# Altium project BenEater_8bitComp.PrjPcb
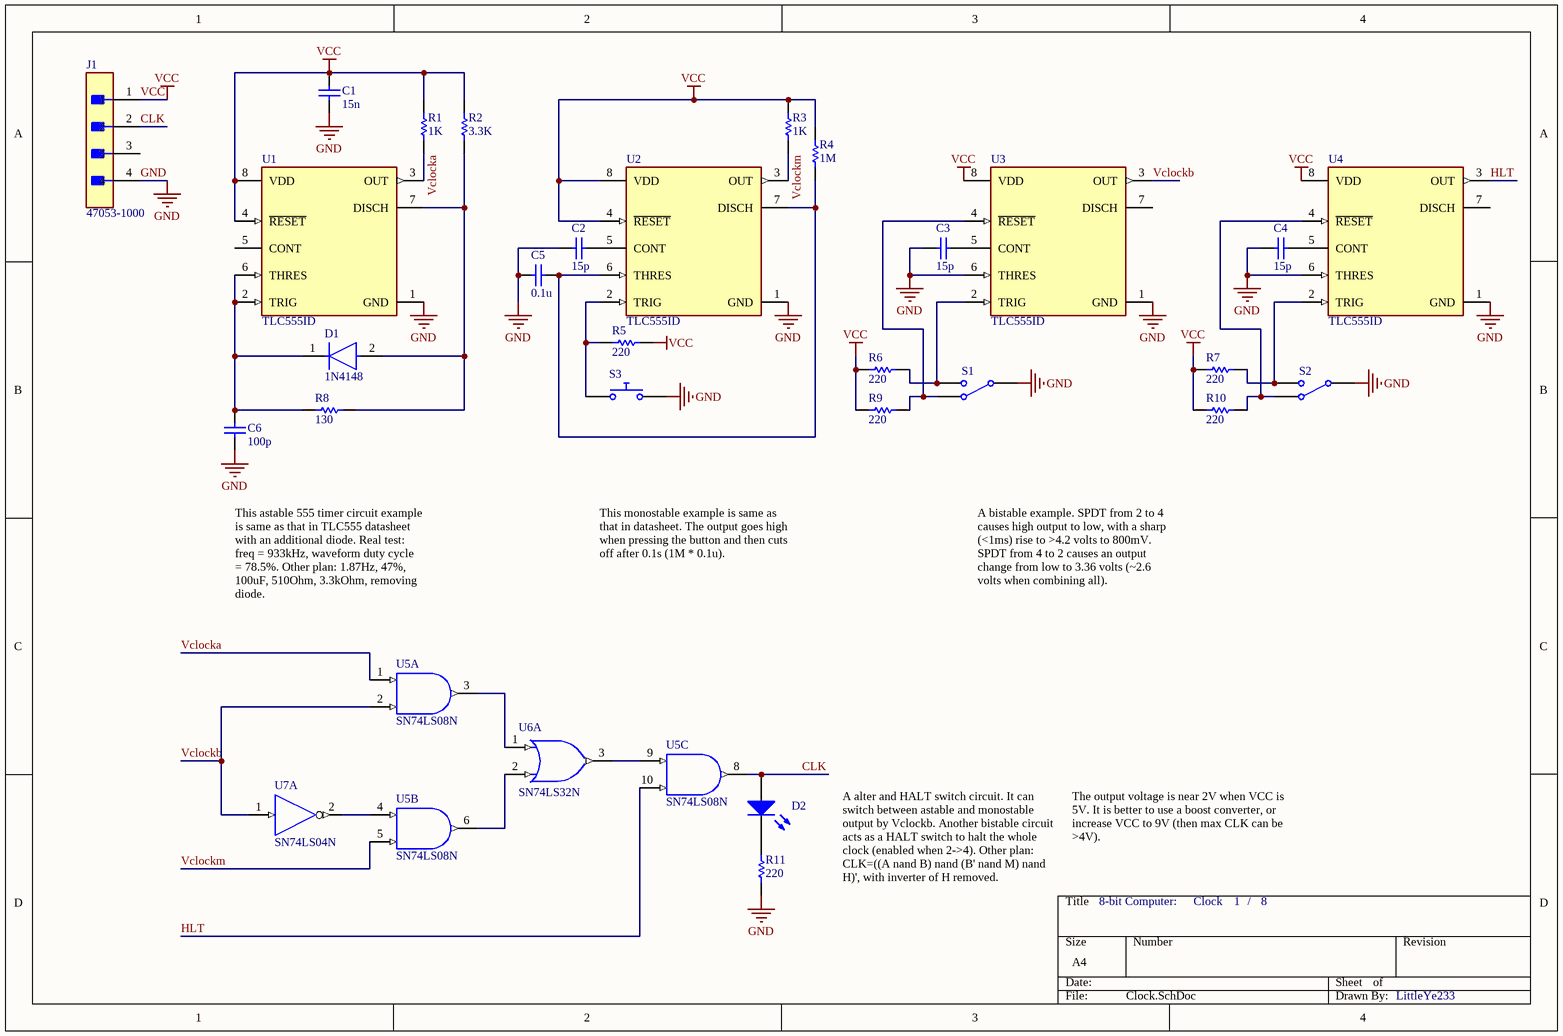
[diagram p0: Clock.SchDoc]
8 sheets, 190 parts. Net scope: global (net labels, ports and power ports of the same name join across sheets).
Sheets:
  Clock.SchDoc
  RegisterA.SchDoc
  RegisterB.SchDoc
  RegisterInstruction.SchDoc
  ALU.SchDoc
  RegisterMemAddr.SchDoc
  RAM.SchDoc
  ProgramCounter.SchDoc

## Sheet Clock.SchDoc: Clock
size A4; Author: Ben Eater; DrawnBy: LittleYe233; DocumentNumber: 1; SheetNumber: 1; SheetTotal: 8

### Parts
C1  value 15n  (hidden comment: Capacitor)
C2  value 15p  (hidden comment: Capacitor)
C3  value 15p  (hidden comment: Capacitor)
C4  value 15p  (hidden comment: Capacitor)
C5  value 0.1u  (hidden comment: Capacitor)
C6  value 100p  (hidden comment: Capacitor)
D1  1N4148  [FP-017AG-MFG]
D2  Light-Emitting Diode  (value not drawn)
J1  47053-1000  [FP-470531000-MFG]
R1  value 1K  (hidden comment: Resistor)
R2  value 3.3K  (hidden comment: Resistor)
R3  value 1K  (hidden comment: Resistor)
R4  value 1M  (hidden comment: Resistor)
R5  value 220  (hidden comment: Resistor)
R6  value 220  (hidden comment: Resistor)
R7  value 220  (hidden comment: Resistor)
R8  value 130  (hidden comment: Resistor)
R9  value 220  (hidden comment: Resistor)
R10  value 220  (hidden comment: Resistor)
R11  value 220  (hidden comment: Resistor)
S1  Single-Pole, Double-Throw Switch  (value not drawn)
S2  Single-Pole, Double-Throw Switch  (value not drawn)
S3  Push Button Normally Opened  (value not drawn)
U1  TLC555ID  [FP-D0008A-IPC_B]
U2  TLC555ID  [FP-D0008A-IPC_B]
U3  TLC555ID  [FP-D0008A-IPC_B]
U4  TLC555ID  [FP-D0008A-IPC_B]
U5  SN74LS08N  [N0014A]  (parts A,B,C of 5)
U6  SN74LS32N  [N0014A]  (part A of 5)
U7  SN74LS04N  [N0014A]  (part A of 7)

### Nets
GND: C1.1 C2.2 C3.2 C4.2 C5.2 C6.1 J1.4 R11.1 S1.1 S2.1 S3.2 U1.1(GND) U2.1(GND) U3.1(GND) U3.6(THRES) U4.1(GND) U4.6(THRES)
VCC: C1.2 J1.1 R1.2 R2.2 R3.2 R4.2 R5.1 R6.1 R7.1 R9.2 R10.2 U1.4(~{RESET}) U1.8(VDD) U2.4(~{RESET}) U2.8(VDD) U3.8(VDD) U4.8(VDD)
CLK: D2.1(A) J1.2 U5.8(3Y)
HLT: U4.3(OUT) U5.10(3B)
Vclocka: R1.1 U1.3(OUT) U5.1(1A)
Vclockb: U3.3(OUT) U5.2(1B) U7.1(1A)
Vclockm: R3.1 U2.3(OUT) U5.5(2B)
NetC2_1: C2.1 U2.5(CONT)
NetC3_1: C3.1 U3.5(CONT)
NetC4_1: C4.1 U4.5(CONT)
NetC5_1: C5.1 R4.1 U2.6(THRES) U2.7(DISCH)
NetC6_2: C6.2 D1.1(C) R8.1 U1.2(TRIG) U1.6(THRES)
NetD1_2: D1.2(A) R2.1 R8.2 U1.7(DISCH)
NetD2_2: D2.2(K) R11.2
NetR5_2: R5.2 S3.1 U2.2(TRIG)
NetR6_2: R6.2 S1.2 U3.2(TRIG)
NetR7_2: R7.2 S2.2 U4.2(TRIG)
NetR9_1: R9.1 S1.3 U3.4(~{RESET})
NetR10_1: R10.1 S2.3 U4.4(~{RESET})
NetU5_3: U5.3(1Y) U6.1(1A)
NetU5_4: U5.4(2A) U7.2(~{1Y})
NetU5_6: U5.6(2Y) U6.2(1B)
NetU5_9: U5.9(3A) U6.3(1Y)

Not connected (* = marked no-connect by the designer): J1 3; U1 5(CONT); U3 7(DISCH); U4 7(DISCH)

### Notes on the sheet
- This monostable example is same as that in datasheet. The output goes high when pressing the button and then cuts off after 0.1s (1M * 0.1u).
- A bistable example. SPDT from 2 to 4 causes high output to low, with a sharp (<1ms) rise to >4.2 volts to 800mV. SPDT from 4 to 2 causes an output change from low to 3.36 volts (~2.6 volts when combining all).
- This astable 555 timer circuit example is same as that in TLC555 datasheet with an additional diode. Real test: freq = 933kHz, waveform duty cycle = 78.5%. Other plan: 1.87Hz, 47%, 100uF, 510Ohm, 3.3kOhm, removing diode.
- The output voltage is near 2V when VCC is 5V. It is better to use a boost converter, or increase VCC to 9V (then max CLK can be >4V).
- A alter and HALT switch circuit. It can switch between astable and monostable output by Vclockb. Another bistable circuit acts as a HALT switch to halt the whole clock (enabled when 2->4). Other plan: CLK=((A nand B) nand (B' nand M) nand H)', with inverter of H removed.
- 8-bit Computer:
- /

### Library data of the parts
C1-C6 = Capacitor: SimulationGenericComponent: True
D1 = CMP-07163-000046-1: DIODE GEN PURP 100V 200MA DO35; Forward Voltage: 1V; Max Power Dissipation: 500mW; Max Reverse Current: 5uA; Forward Current: 300mA; Current: 4A; Reverse Recovery Time: 4ns; Element Configuration: Single; Outside Diameter: 1.85mm; Capacitance: 4pF; Polarity: Standard; Max Forward Surge Current (Ifsm): 1A; Reverse Voltage: 100V; Output Current: 200mA; Average Rectified Current: 200mA; Diameter: 1.91mm; Max Repetitive Reverse Voltage (Vrrm): 100V; Current Rating: 200mA; Case/Package: DO-35; Lead Free: Lead Free; Number of Pins: 2; Recovery Time: 4ns; Packaging: Bulk; Contact Plating: Tin; Voltage: 100V; Mount: Through Hole; Max Surge Current: 4A; Package Quantity: 2000; Width: 1.91mm; Max Reverse Voltage (DC): 100V; Length: 4.56mm; Radiation Hardening: No; Power Dissipation: 500mW; Voltage Rating (DC): 100V; Peak Non-Repetitive Surge Current: 4A; REACH SVHC: No SVHC; Height: 4.56mm; Max Operating Temperature: 175°C; Series: -; Weight: 0.01lb; Min Operating Temperature: -65°C
D2 = LED: AF: 1; BV: 0; BV_MAX: 1e99; EG: 1.11; FC: 0.5; IBV: 0.001; IS: 1e-14; MJSW: 0.33; NTUN: 30; TNOM: 27; XTI: 3; SimulationGenericComponent: True; CJO: 0; CJP: 0; CTA: 0; CTP: 0; FCS: 0.5; FV_MAX: 1e99; IKF: 0; IKR: 0; ISR: 1e-14; JSW: 0; JTUN: 0; JTUNSW: 0; KEG: 1; KF: 0; LEVEL: 1; N: 1; NBV: 1; NR: 1; NS: 1; PHP: 1; RS: 0; TCV: 0; TLEV: 0; TLEVC: 0; TM1: 0; TM2: 0; TPB: 0; TPHP: 0; TRS: 0; TRS2: 0; TT: 0; TTT1: 0; TTT2: 0; VJ: 1; XTITUN: 3
J1 = CMP-04776-000290-2: CONN HEADER VERT 4POS 2.54MM; NexarPartId: 854935; Manufacturer Lifecycle Status: ACTIVE; Voltage Rating (DC): 250V; Gender: Male; Plating: Copper; Number of Positions: 4; Glow Wire Compliant: Non-compliant; Current Rating: 500mA; Max Operating Temperature: 75°C; Number of Rows: 1; REACH SVHC: Unknown; Ambient Temperature Range High: 105°C; Pitch: 2.54mm; Height: 7.7mm; Min Operating Temperature: 0°C; Packaging: Bulk; Contact Material: Brass, Copper; Contact Plating: Tin; Lead Pitch: 2.54mm; Voltage Rating: 250V; Termination: Through Hole; Radiation Hardening: No; Orientation: Vertical; Mount: Through Hole; Number of Pins: 4; Country of Origin: HK; Halogen Free: Low Halogen; Lifecycle Status: Production; Number of Circuits: 4; Schedule B: 8536694040, 8536694040|8536694040|8536694040|8536694040|8536694040|8536694040|8536694040|8536694040|8536694040|8536694040|8536694040|8536694040|8536694040|8536694040|8536694040|8536694040|8536694040|8536694040|8536694040|8536694040|8536694040|8536694040|8536694040|85; Housing Color: Beige; Housing Material: Nylon; Depth: 5.84mm; RoHS: Compliant; Length: 10.2mm; Number of Contacts: 4
R1-R11 = Resistor: TC1: 0; SimulationGenericComponent: True; TC2: 0
S1 S2 = SPDT SW: nodeUP_closed: 1; Rclosed: 1m; Ropen: 1Meg; SimulationGenericComponent: True
S3 = Push Button NO: closed: 0; Rclosed: 1m; Ropen: 1Meg; SimulationGenericComponent: True
U1-U4 = CMP-04858-000007-1: IC OSC SGL TIMER 2.1MHZ 8-SOIC; Manufacturer: Texas Instruments; Nominal Supply Current: 170-360uA; Min Supply Voltage: 3V; Max Supply Voltage: 15V; Number Of Timers/Counters: 1; Standoff Height: 0.11mm; RoHS: TRUE; Package: D0008A; Automotive: No; ComponentLink2Description: Datasheet; Category: IC; Mouser Description: Timers & Support Products CMOS; Ambient Temperature Range High: +85°C; Device Class L1: Integrated Circuits (ICs); Lead Free: Yes; Temperature: -40°C to +85°C; Frequency: 2.1MHz; Device Class L2: Clock and Timing; ComponentLink2URL: http://www.ti.com/lit/ds/symlink/tlc555.pdf; Ambient Temperature Range Low: -40°C; Device Class L3: Timers and Oscillators; Temperature Range High: +85°C; Temperature Range Low: -40°C; Octopart: https://octopart.com/tlc555id-texas+instruments-516571; Digikey Description: IC OSC SGL TIMER 2.1MHZ 8-SOIC; Height: 1.75mm; Manufacturer Part Number: TLC555ID
U5 = CMP-0777-00259-3: Quadruple 2-Input Positive-AND Gates, N0014A, TUBE; Manufacturer: Texas Instruments; VCC(Max)(V): 5.25; ICC @ Nom Voltage(Max)(mA): 0.021; VCC(Min)(V): 4.75; tpd @ Nom Voltage(Max)(ns): 25; Rating: Catalog; Output Type: TTL; Bits(#): 4; Schmitt Trigger: No; Voltage(Nom)(V): 5; Technology Family: LS; F @ Nom Voltage(Max)(Mhz): 35; Output Drive (IOL/IOH)(Max)(mA): -0.8/16; PackageReference: N0014A; DatasheetVersion: SDLS033; Input Type: TTL; Operating Temperature Range(C): 0 to 70; Generic Part Number: SN74LS08
U6 = CMP-1573-00145-3: Quad 2-input positive-OR gates, N0014A, TUBE; Manufacturer: Texas Instruments; tpd @ Nom Voltage(Max)(ns): 22; Output Drive (IOL/IOH)(Max)(mA): 0.8/-16; Input Type: TTL; VCC(Min)(V): 4.75; F @ Nom Voltage(Max)(Mhz): 35; Voltage(Nom)(V): 5; ICC @ Nom Voltage(Max)(mA): 0.038; VCC(Max)(V): 5.25; Rating: Catalog; Bits(#): 4; Generic Part Number: SN74LS32; DatasheetVersion: SDLS100; Operating Temperature Range(C): 0 to 70; Output Type: TTL; Code_JEDEC: MS-001; PackageVersion: http://www.ti.com/lit/ml/mpdi002c/mpdi002c.pdf; PackageReference: N0014A
U7 = CMP-1615-00911-2: Hex inverters, N0014A, TUBE; Manufacturer: Texas Instruments; Output Drive (IOL/IOH)(Max)(mA): -0.4/8; Schmitt Trigger: No; F @ Nom Voltage(Max)(Mhz): 35; Voltage(Nom)(V): 5; Technology Family: LS; Input Type: TTL; Output Type: CMOS; Bits(#): 6; VCC(Max)(V): 5.25; ICC @ Nom Voltage(Max)(mA): 0.033; Rating: Catalog; VCC(Min)(V): 4.75; tpd @ Nom Voltage(Max)(ns): 22; Operating Temperature Range(C): 0 to 70; DatasheetVersion: SDLS029C; Generic Part Number: SN74LS04; Code_JEDEC: MS-001; PackageReference: N0014A

## Sheet RegisterA.SchDoc: A Register
size A4; Author: Ben Eater; DrawnBy: LittleYe233; DocumentNumber: 2; SheetNumber: 2; SheetTotal: 7
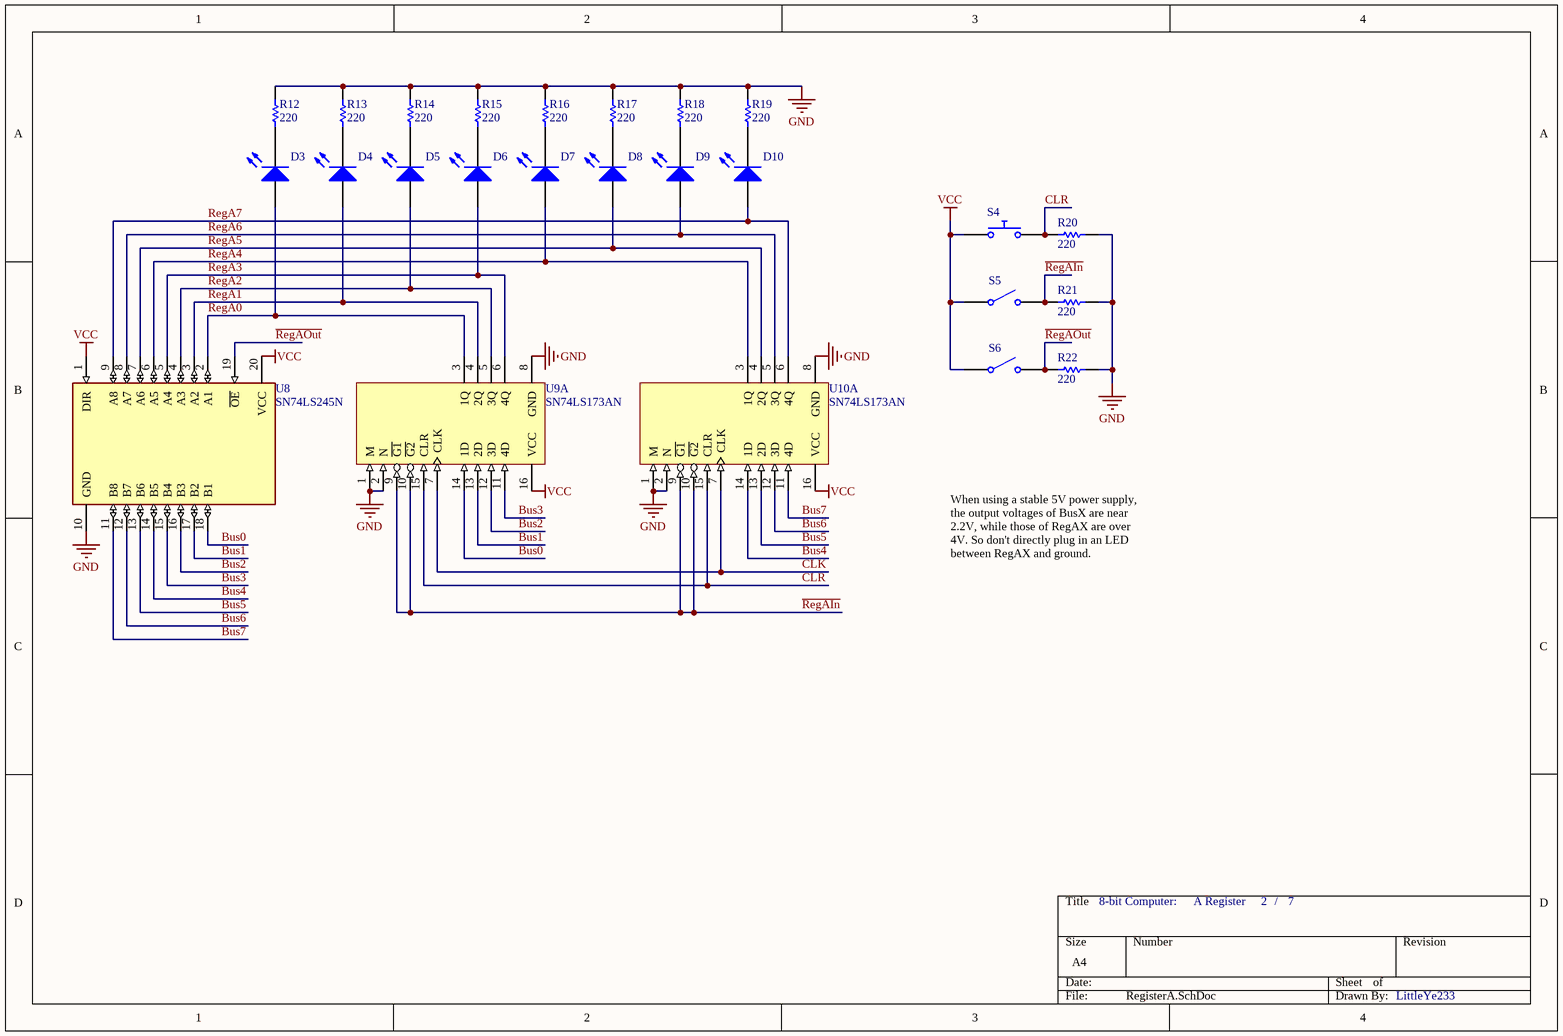
[diagram p1: RegisterA.SchDoc]

### Parts
D3  Light-Emitting Diode  (value not drawn)
D4  Light-Emitting Diode  (value not drawn)
D5  Light-Emitting Diode  (value not drawn)
D6  Light-Emitting Diode  (value not drawn)
D7  Light-Emitting Diode  (value not drawn)
D8  Light-Emitting Diode  (value not drawn)
D9  Light-Emitting Diode  (value not drawn)
D10  Light-Emitting Diode  (value not drawn)
R12  value 220  (hidden comment: Resistor)
R13  value 220  (hidden comment: Resistor)
R14  value 220  (hidden comment: Resistor)
R15  value 220  (hidden comment: Resistor)
R16  value 220  (hidden comment: Resistor)
R17  value 220  (hidden comment: Resistor)
R18  value 220  (hidden comment: Resistor)
R19  value 220  (hidden comment: Resistor)
R20  value 220  (hidden comment: Resistor)
R21  value 220  (hidden comment: Resistor)
R22  value 220  (hidden comment: Resistor)
S4  Push Button Normally Opened  (value not drawn)
S5  Single-Pole, Single-Throw Switch  (value not drawn)
S6  Single-Pole, Single-Throw Switch  (value not drawn)
U8  SN74LS245N  [FP-N0020A-MFG]
U9  SN74LS173AN  [N0016A]  (part A of 2)
U10  SN74LS173AN  [N0016A]  (part A of 2)

### Nets
GND: R12.2 R13.2 R14.2 R15.2 R16.2 R17.2 R18.2 R19.2 R20.1 R21.1 R22.1 U8.10(GND) U9.1(M) U9.2(N) U9.8(GND) U10.1(M) U10.2(N) U10.8(GND)
VCC: S4.1 S5.1 S6.1 U8.1(DIR) U8.20(VCC) U9.16(VCC) U10.16(VCC)
Bus0: U8.18(B1) U9.14(1D)
Bus1: U8.17(B2) U9.13(2D)
Bus2: U8.16(B3) U9.12(3D)
Bus3: U8.15(B4) U9.11(4D)
Bus4: U8.14(B5) U10.14(1D)
Bus5: U8.13(B6) U10.13(2D)
Bus6: U8.12(B7) U10.12(3D)
Bus7: U8.11(B8) U10.11(4D)
CLK: U9.7(CLK) U10.7(CLK)
CLR: R20.2 S4.2 U9.15(CLR) U10.15(CLR)
~{RegAIn}: R21.2 S5.2 U9.9(~{G1}) U9.10(~{G2}) U10.9(~{G1}) U10.10(~{G2})
~{RegAOut}: R22.2 S6.2 U8.19(~{OE})
RegA0: D3.1(A) U8.2(A1) U9.3(1Q)
RegA1: D4.1(A) U8.3(A2) U9.4(2Q)
RegA2: D5.1(A) U8.4(A3) U9.5(3Q)
RegA3: D6.1(A) U8.5(A4) U9.6(4Q)
RegA4: D7.1(A) U8.6(A5) U10.3(1Q)
RegA5: D8.1(A) U8.7(A6) U10.4(2Q)
RegA6: D9.1(A) U8.8(A7) U10.5(3Q)
RegA7: D10.1(A) U8.9(A8) U10.6(4Q)
NetD3_2: D3.2(K) R12.1
NetD4_2: D4.2(K) R13.1
NetD5_2: D5.2(K) R14.1
NetD6_2: D6.2(K) R15.1
NetD7_2: D7.2(K) R16.1
NetD8_2: D8.2(K) R17.1
NetD9_2: D9.2(K) R18.1
NetD10_2: D10.2(K) R19.1

### Notes on the sheet
- When using a stable 5V power supply, the output voltages of BusX are near 2.2V, while those of RegAX are over 4V. So don't directly plug in an LED between RegAX and ground.
- 8-bit Computer:
- /

### Library data of the parts
D3-D10 = LED: as D2 on sheet Clock; CJO: 0; CJP: 0; CTA: 0; CTP: 0; FCS: 0.5; FV_MAX: 1e99; IKF: 0; IKR: 0; ISR: 1e-14; JSW: 0; JTUN: 0; JTUNSW: 0; KEG: 1; KF: 0; LEVEL: 1; N: 1; NBV: 1; NR: 1; NS: 1; PHP: 1; RS: 0; TCV: 0; TLEV: 0; TLEVC: 0; TM1: 0; TM2: 0; TPB: 0; TPHP: 0; TRS: 0; TRS2: 0; TT: 0; TTT1: 0; TTT2: 0; VJ: 1; XTITUN: 3
R12-R22 = Resistor: TC1: 0; SimulationGenericComponent: True; TC2: 0
S4 = Push Button NO: as S3 on sheet Clock
S5 S6 = SPST SW: closed: 0; Rclosed: 1m; Ropen: 1Meg; SimulationGenericComponent: True
U8 = CMP-1620-00419-3: IC TXRX NON-INVERT 5.25V 20DIP; Number of Bits per Element: 8; Polarity: Non-Inverting; Low Level Output Current: 24mA; Propagation Delay: 12ns; Min Supply Voltage: 4.75V; Number of Elements: 1; Quiescent Current: 62mA; Logic Function: Transceiver; Direction: Bidirectional; Operating Supply Voltage: 5V; High Level Output Current: -15mA; Mount: Through Hole; Min Operating Temperature: 0°C; Number of Outputs: 8; Max Operating Temperature: 70°C; Max Supply Voltage: 5.25V; Width: 6.35mm; Number of Pins: 20; RoHS Compliant: Yes; Turn-On Delay Time: 12ns; Termination: Through Hole; Number of Channels: 8; Number of Circuits: 8; Weight: 0.042297oz; Package Quantity: 20; Number of Transceivers: 8; Length: 24.33mm; Height: 4.57mm; REACH SVHC: No SVHC; Contact Plating: Gold; Number of Bits: 8; Lead Free: Lead Free; Case/Package: PDIP; Packaging: Rail/Tube; Radiation Hardening: No
U9 U10 = CMP-1619-00777-2: 4-Bit D-type Registers with 3-State Outputs, N0016A, TUBE; Manufacturer: Texas Instruments; VCC(Max)(V): 5.25; ICC @ Nom Voltage(Max)(mA): 24; F @ Nom Voltage(Max)(Mhz): 35; Bits(#): 4; tpd @ Nom Voltage(Max)(ns): 30; Output Logic: Non-inverted; VCC(Min)(V): 4.75; 3-State Output: Yes; Voltage(Nom)(V): 5; Output Drive (IOL/IOH)(Max)(mA): 24/-2.6; Rating: Catalog; Output: 3S; Input Type: TTL; Technology Family: LS; Schmitt Trigger: No; Operating Temperature Range(C): 0 to 70; DatasheetVersion: SDLS067A; Generic Part Number: SN74LS173A; Output Type: TTL; PackageReference: N0016A; Code_JEDEC: MS-001

## Sheet RegisterB.SchDoc: B Register
size A4; Author: Ben Eater; DrawnBy: LittleYe233; SheetNumber: 3; SheetTotal: 6
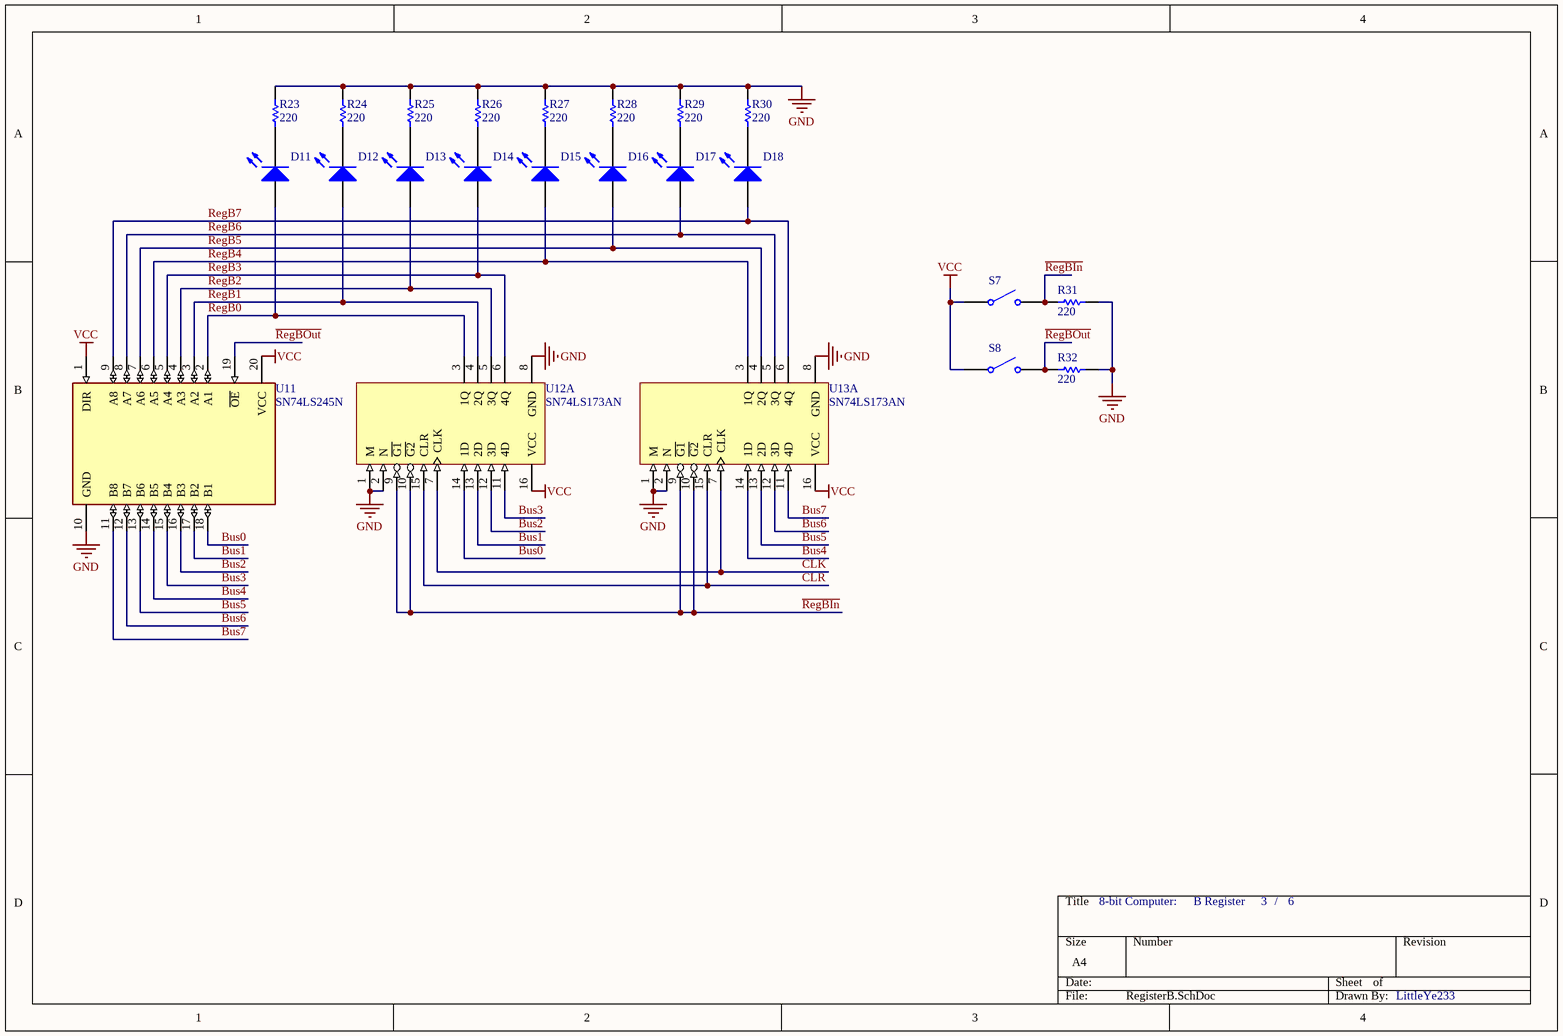
[diagram p2: RegisterB.SchDoc]

### Parts
D11  Light-Emitting Diode  (value not drawn)
D12  Light-Emitting Diode  (value not drawn)
D13  Light-Emitting Diode  (value not drawn)
D14  Light-Emitting Diode  (value not drawn)
D15  Light-Emitting Diode  (value not drawn)
D16  Light-Emitting Diode  (value not drawn)
D17  Light-Emitting Diode  (value not drawn)
D18  Light-Emitting Diode  (value not drawn)
R23  value 220  (hidden comment: Resistor)
R24  value 220  (hidden comment: Resistor)
R25  value 220  (hidden comment: Resistor)
R26  value 220  (hidden comment: Resistor)
R27  value 220  (hidden comment: Resistor)
R28  value 220  (hidden comment: Resistor)
R29  value 220  (hidden comment: Resistor)
R30  value 220  (hidden comment: Resistor)
R31  value 220  (hidden comment: Resistor)
R32  value 220  (hidden comment: Resistor)
S7  Single-Pole, Single-Throw Switch  (value not drawn)
S8  Single-Pole, Single-Throw Switch  (value not drawn)
U11  SN74LS245N  [FP-N0020A-MFG]
U12  SN74LS173AN  [N0016A]  (part A of 2)
U13  SN74LS173AN  [N0016A]  (part A of 2)

### Nets
GND: R23.2 R24.2 R25.2 R26.2 R27.2 R28.2 R29.2 R30.2 R31.1 R32.1 U11.10(GND) U12.1(M) U12.2(N) U12.8(GND) U13.1(M) U13.2(N) U13.8(GND)
VCC: S7.1 S8.1 U11.1(DIR) U11.20(VCC) U12.16(VCC) U13.16(VCC)
Bus0: U11.18(B1) U12.14(1D)
Bus1: U11.17(B2) U12.13(2D)
Bus2: U11.16(B3) U12.12(3D)
Bus3: U11.15(B4) U12.11(4D)
Bus4: U11.14(B5) U13.14(1D)
Bus5: U11.13(B6) U13.13(2D)
Bus6: U11.12(B7) U13.12(3D)
Bus7: U11.11(B8) U13.11(4D)
CLK: U12.7(CLK) U13.7(CLK)
CLR: U12.15(CLR) U13.15(CLR)
~{RegBIn}: R31.2 S7.2 U12.9(~{G1}) U12.10(~{G2}) U13.9(~{G1}) U13.10(~{G2})
~{RegBOut}: R32.2 S8.2 U11.19(~{OE})
RegB0: D11.1(A) U11.2(A1) U12.3(1Q)
RegB1: D12.1(A) U11.3(A2) U12.4(2Q)
RegB2: D13.1(A) U11.4(A3) U12.5(3Q)
RegB3: D14.1(A) U11.5(A4) U12.6(4Q)
RegB4: D15.1(A) U11.6(A5) U13.3(1Q)
RegB5: D16.1(A) U11.7(A6) U13.4(2Q)
RegB6: D17.1(A) U11.8(A7) U13.5(3Q)
RegB7: D18.1(A) U11.9(A8) U13.6(4Q)
NetD11_2: D11.2(K) R23.1
NetD12_2: D12.2(K) R24.1
NetD13_2: D13.2(K) R25.1
NetD14_2: D14.2(K) R26.1
NetD15_2: D15.2(K) R27.1
NetD16_2: D16.2(K) R28.1
NetD17_2: D17.2(K) R29.1
NetD18_2: D18.2(K) R30.1

### Notes on the sheet
- 8-bit Computer:
- /

### Library data of the parts
D11-D18 = LED: as D2 on sheet Clock; CJO: 0; CJP: 0; CTA: 0; CTP: 0; FCS: 0.5; FV_MAX: 1e99; IKF: 0; IKR: 0; ISR: 1e-14; JSW: 0; JTUN: 0; JTUNSW: 0; KEG: 1; KF: 0; LEVEL: 1; N: 1; NBV: 1; NR: 1; NS: 1; PHP: 1; RS: 0; TCV: 0; TLEV: 0; TLEVC: 0; TM1: 0; TM2: 0; TPB: 0; TPHP: 0; TRS: 0; TRS2: 0; TT: 0; TTT1: 0; TTT2: 0; VJ: 1; XTITUN: 3
R23-R32 = Resistor: TC1: 0; SimulationGenericComponent: True; TC2: 0
S7 S8 = SPST SW: as S5 on sheet RegisterA
U11 = CMP-1620-00419-3: as U8 on sheet RegisterA; Mount: Through Hole; Min Operating Temperature: 0°C; Number of Outputs: 8; Max Operating Temperature: 70°C; Max Supply Voltage: 5.25V; Width: 6.35mm; Number of Pins: 20; RoHS Compliant: Yes; Turn-On Delay Time: 12ns; Termination: Through Hole; Number of Channels: 8; Number of Circuits: 8; Weight: 0.042297oz; Package Quantity: 20; Number of Transceivers: 8; Length: 24.33mm; Height: 4.57mm; REACH SVHC: No SVHC; Contact Plating: Gold; Number of Bits: 8; Lead Free: Lead Free; Case/Package: PDIP; Packaging: Rail/Tube; Radiation Hardening: No
U12 U13 = CMP-1619-00777-2: as U9 on sheet RegisterA; Operating Temperature Range(C): 0 to 70; DatasheetVersion: SDLS067A; Generic Part Number: SN74LS173A; Output Type: TTL; PackageReference: N0016A; Code_JEDEC: MS-001

## Sheet RegisterInstruction.SchDoc: Instruction Register
size A4; Author: Ben Eater; DrawnBy: LittleYe233; SheetNumber: 4; SheetTotal: 7
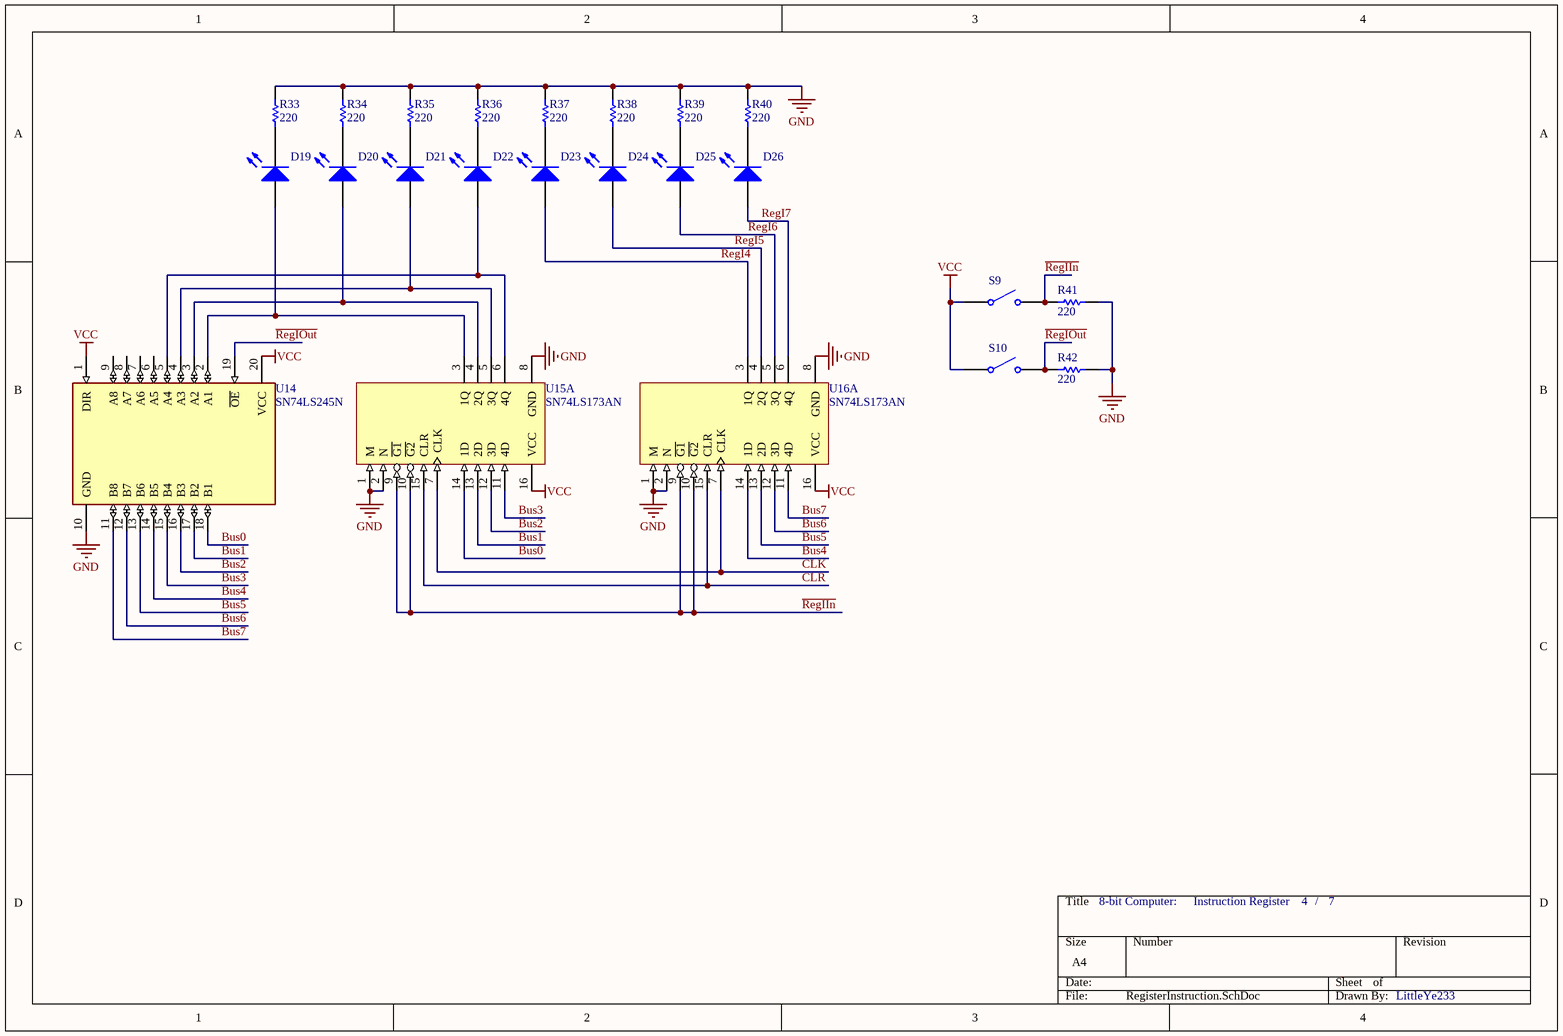
[diagram p3: RegisterInstruction.SchDoc]

### Parts
D19  Light-Emitting Diode  (value not drawn)
D20  Light-Emitting Diode  (value not drawn)
D21  Light-Emitting Diode  (value not drawn)
D22  Light-Emitting Diode  (value not drawn)
D23  Light-Emitting Diode  (value not drawn)
D24  Light-Emitting Diode  (value not drawn)
D25  Light-Emitting Diode  (value not drawn)
D26  Light-Emitting Diode  (value not drawn)
R33  value 220  (hidden comment: Resistor)
R34  value 220  (hidden comment: Resistor)
R35  value 220  (hidden comment: Resistor)
R36  value 220  (hidden comment: Resistor)
R37  value 220  (hidden comment: Resistor)
R38  value 220  (hidden comment: Resistor)
R39  value 220  (hidden comment: Resistor)
R40  value 220  (hidden comment: Resistor)
R41  value 220  (hidden comment: Resistor)
R42  value 220  (hidden comment: Resistor)
S9  Single-Pole, Single-Throw Switch  (value not drawn)
S10  Single-Pole, Single-Throw Switch  (value not drawn)
U14  SN74LS245N  [FP-N0020A-MFG]
U15  SN74LS173AN  [N0016A]  (part A of 2)
U16  SN74LS173AN  [N0016A]  (part A of 2)

### Nets
GND: R33.2 R34.2 R35.2 R36.2 R37.2 R38.2 R39.2 R40.2 R41.1 R42.1 U14.10(GND) U15.1(M) U15.2(N) U15.8(GND) U16.1(M) U16.2(N) U16.8(GND)
VCC: S9.1 S10.1 U14.1(DIR) U14.20(VCC) U15.16(VCC) U16.16(VCC)
Bus0: U14.18(B1) U15.14(1D)
Bus1: U14.17(B2) U15.13(2D)
Bus2: U14.16(B3) U15.12(3D)
Bus3: U14.15(B4) U15.11(4D)
Bus4: U14.14(B5) U16.14(1D)
Bus5: U14.13(B6) U16.13(2D)
Bus6: U14.12(B7) U16.12(3D)
Bus7: U14.11(B8) U16.11(4D)
CLK: U15.7(CLK) U16.7(CLK)
CLR: U15.15(CLR) U16.15(CLR)
~{RegIIn}: R41.2 S9.2 U15.9(~{G1}) U15.10(~{G2}) U16.9(~{G1}) U16.10(~{G2})
~{RegIOut}: R42.2 S10.2 U14.19(~{OE})
RegI4: D23.1(A) U16.3(1Q)
RegI5: D24.1(A) U16.4(2Q)
RegI6: D25.1(A) U16.5(3Q)
RegI7: D26.1(A) U16.6(4Q)
NetD19_1: D19.1(A) U14.2(A1) U15.3(1Q)
NetD19_2: D19.2(K) R33.1
NetD20_1: D20.1(A) U14.3(A2) U15.4(2Q)
NetD20_2: D20.2(K) R34.1
NetD21_1: D21.1(A) U14.4(A3) U15.5(3Q)
NetD21_2: D21.2(K) R35.1
NetD22_1: D22.1(A) U14.5(A4) U15.6(4Q)
NetD22_2: D22.2(K) R36.1
NetD23_2: D23.2(K) R37.1
NetD24_2: D24.2(K) R38.1
NetD25_2: D25.2(K) R39.1
NetD26_2: D26.2(K) R40.1

Not connected (* = marked no-connect by the designer): U14 6(A5) 7(A6) 8(A7) 9(A8)

### Notes on the sheet
- 8-bit Computer:
- /

### Library data of the parts
D19-D26 = LED: as D2 on sheet Clock; CJO: 0; CJP: 0; CTA: 0; CTP: 0; FCS: 0.5; FV_MAX: 1e99; IKF: 0; IKR: 0; ISR: 1e-14; JSW: 0; JTUN: 0; JTUNSW: 0; KEG: 1; KF: 0; LEVEL: 1; N: 1; NBV: 1; NR: 1; NS: 1; PHP: 1; RS: 0; TCV: 0; TLEV: 0; TLEVC: 0; TM1: 0; TM2: 0; TPB: 0; TPHP: 0; TRS: 0; TRS2: 0; TT: 0; TTT1: 0; TTT2: 0; VJ: 1; XTITUN: 3
R33-R42 = Resistor: TC1: 0; SimulationGenericComponent: True; TC2: 0
S9 S10 = SPST SW: as S5 on sheet RegisterA
U14 = CMP-1620-00419-3: as U8 on sheet RegisterA; Mount: Through Hole; Min Operating Temperature: 0°C; Number of Outputs: 8; Max Operating Temperature: 70°C; Max Supply Voltage: 5.25V; Width: 6.35mm; Number of Pins: 20; RoHS Compliant: Yes; Turn-On Delay Time: 12ns; Termination: Through Hole; Number of Channels: 8; Number of Circuits: 8; Weight: 0.042297oz; Package Quantity: 20; Number of Transceivers: 8; Length: 24.33mm; Height: 4.57mm; REACH SVHC: No SVHC; Contact Plating: Gold; Number of Bits: 8; Lead Free: Lead Free; Case/Package: PDIP; Packaging: Rail/Tube; Radiation Hardening: No
U15 U16 = CMP-1619-00777-2: as U9 on sheet RegisterA; Operating Temperature Range(C): 0 to 70; DatasheetVersion: SDLS067A; Generic Part Number: SN74LS173A; Output Type: TTL; PackageReference: N0016A; Code_JEDEC: MS-001

## Sheet ALU.SchDoc: ALU
size A4; Author: Ben Eater; DrawnBy: LittleYe233; SheetNumber: 5; SheetTotal: 6
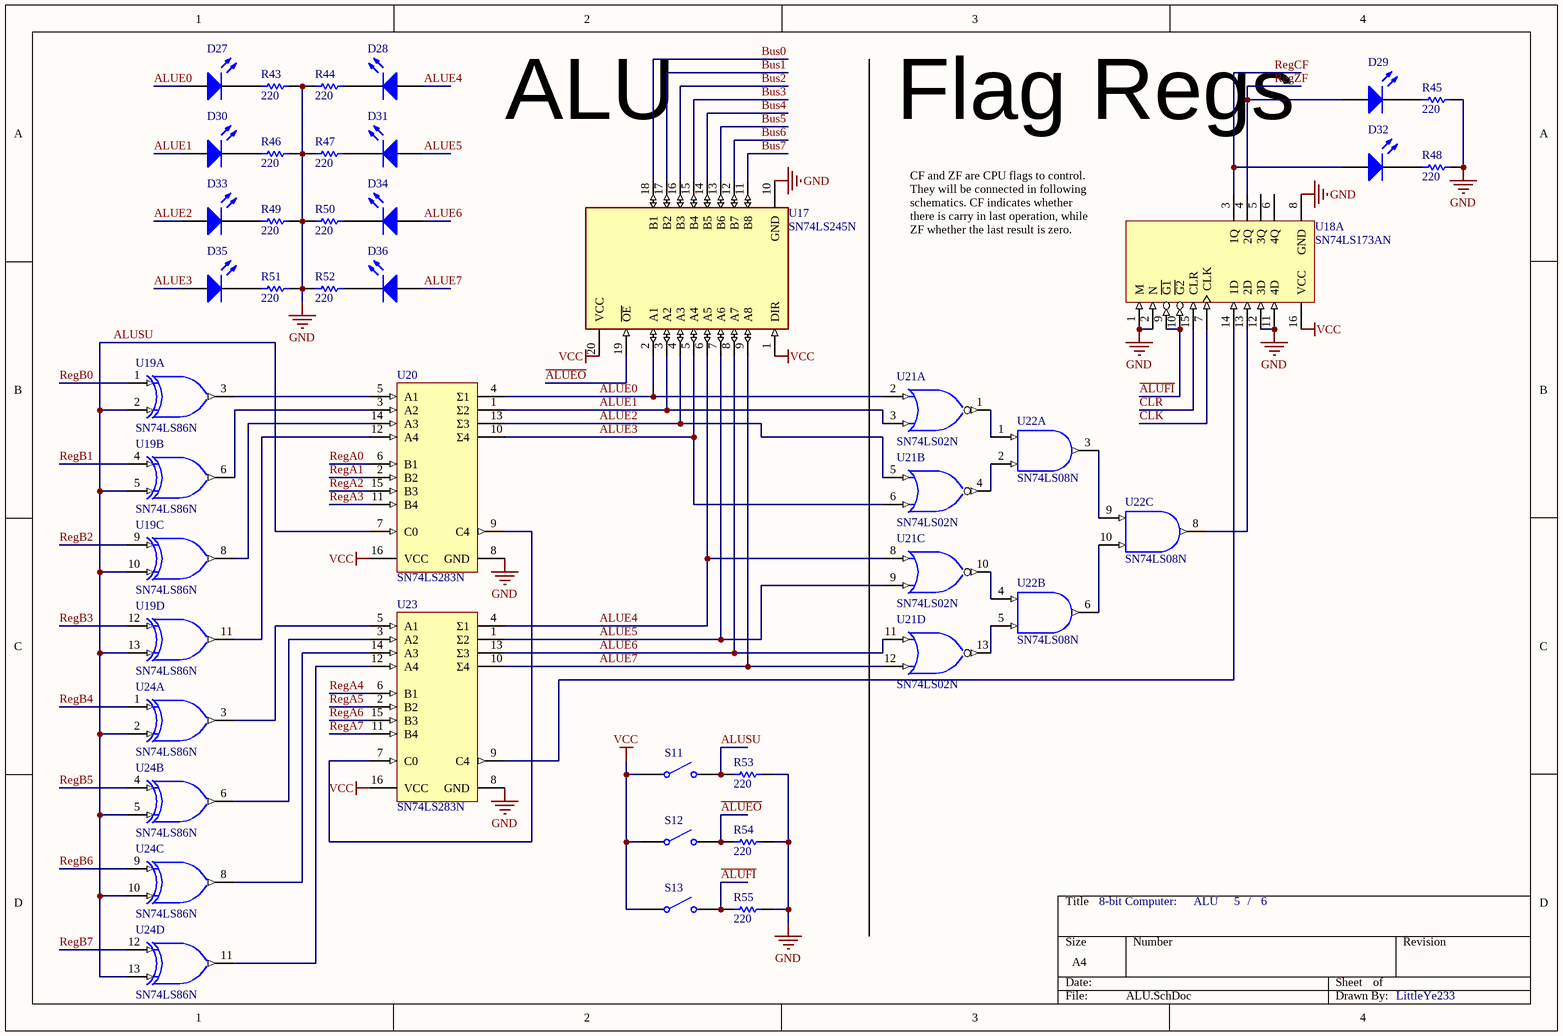
[diagram p4: ALU.SchDoc]

### Parts
D27  Light-Emitting Diode  (value not drawn)
D28  Light-Emitting Diode  (value not drawn)
D29  Light-Emitting Diode  (value not drawn)
D30  Light-Emitting Diode  (value not drawn)
D31  Light-Emitting Diode  (value not drawn)
D32  Light-Emitting Diode  (value not drawn)
D33  Light-Emitting Diode  (value not drawn)
D34  Light-Emitting Diode  (value not drawn)
D35  Light-Emitting Diode  (value not drawn)
D36  Light-Emitting Diode  (value not drawn)
R43  value 220  (hidden comment: Resistor)
R44  value 220  (hidden comment: Resistor)
R45  value 220  (hidden comment: Resistor)
R46  value 220  (hidden comment: Resistor)
R47  value 220  (hidden comment: Resistor)
R48  value 220  (hidden comment: Resistor)
R49  value 220  (hidden comment: Resistor)
R50  value 220  (hidden comment: Resistor)
R51  value 220  (hidden comment: Resistor)
R52  value 220  (hidden comment: Resistor)
R53  value 220  (hidden comment: Resistor)
R54  value 220  (hidden comment: Resistor)
R55  value 220  (hidden comment: Resistor)
S11  Single-Pole, Single-Throw Switch  (value not drawn)
S12  Single-Pole, Single-Throw Switch  (value not drawn)
S13  Single-Pole, Single-Throw Switch  (value not drawn)
U17  SN74LS245N  [FP-N0020A-MFG]
U18  SN74LS173AN  [N0016A]  (part A of 2)
U19  SN74LS86N  (parts A,B,C,D of 5)
U20  SN74LS283N  [N0016A]
U21  SN74LS02N  [N0014A]  (parts A,B,C,D of 5)
U22  SN74LS08N  [N0014A]  (parts A,B,C of 5)
U23  SN74LS283N  [N0016A]
U24  SN74LS86N  (parts A,B,C,D of 5)

### Nets
GND: R43.2 R44.1 R45.2 R46.2 R47.1 R48.2 R49.2 R50.1 R51.2 R52.1 R53.1 R54.1 R55.1 U17.10(GND) U18.1(M) U18.2(N) U18.8(GND) U18.11(4D) U18.12(3D) U20.8(GND) U23.8(GND)
VCC: S11.1 S12.1 S13.1 U17.1(DIR) U17.20(VCC) U18.16(VCC) U20.16(VCC) U23.16(VCC)
~{ALUEO}: R54.2 S12.2 U17.19(~{OE})
~{ALUFI}: R55.2 S13.2 U18.9(~{G1}) U18.10(~{G2})
ALUE0: D27.1(A) U17.2(A1) U20.4(Σ1) U21.2(1A)
ALUE1: D30.1(A) U17.3(A2) U20.1(Σ2) U21.3(1B)
ALUE2: D33.1(A) U17.4(A3) U20.13(Σ3) U21.5(2A)
ALUE3: D35.1(A) U17.5(A4) U20.10(Σ4) U21.6(2B)
ALUE4: D28.1(A) U17.6(A5) U21.8(3A) U23.4(Σ1)
ALUE5: D31.1(A) U17.7(A6) U21.9(3B) U23.1(Σ2)
ALUE6: D34.1(A) U17.8(A7) U21.11(4A) U23.13(Σ3)
ALUE7: D36.1(A) U17.9(A8) U21.12(4B) U23.10(Σ4)
ALUSU: R53.2 S11.2 U19.2(1B) U19.5(2B) U19.10(3B) U19.13(4B) U20.7(C0) U24.2(1B) U24.5(2B) U24.10(3B) U24.13(4B)
Bus0: U17.18(B1)
Bus1: U17.17(B2)
Bus2: U17.16(B3)
Bus3: U17.15(B4)
Bus4: U17.14(B5)
Bus5: U17.13(B6)
Bus6: U17.12(B7)
Bus7: U17.11(B8)
CLK: U18.7(CLK)
CLR: U18.15(CLR)
RegA0: U20.6(B1)
RegA1: U20.2(B2)
RegA2: U20.15(B3)
RegA3: U20.11(B4)
RegA4: U23.6(B1)
RegA5: U23.2(B2)
RegA6: U23.15(B3)
RegA7: U23.11(B4)
RegB0: U19.1(1A)
RegB1: U19.4(2A)
RegB2: U19.9(3A)
RegB3: U19.12(4A)
RegB4: U24.1(1A)
RegB5: U24.4(2A)
RegB6: U24.9(3A)
RegB7: U24.12(4A)
RegCF: D32.1(A) U18.3(1Q)
RegZF: D29.1(A) U18.4(2Q)
NetD27_2: D27.2(K) R43.1
NetD28_2: D28.2(K) R44.2
NetD29_2: D29.2(K) R45.1
NetD30_2: D30.2(K) R46.1
NetD31_2: D31.2(K) R47.2
NetD32_2: D32.2(K) R48.1
NetD33_2: D33.2(K) R49.1
NetD34_2: D34.2(K) R50.2
NetD35_2: D35.2(K) R51.1
NetD36_2: D36.2(K) R52.2
NetU18_13: U18.13(2D) U22.8(3Y)
NetU18_14: U18.14(1D) U23.9(C4)
NetU19_3: U19.3(1Y) U20.5(A1)
NetU19_6: U19.6(2Y) U20.3(A2)
NetU19_8: U19.8(3Y) U20.14(A3)
NetU19_11: U19.11(4Y) U20.12(A4)
NetU20_9: U20.9(C4) U23.7(C0)
NetU21_1: U21.1(1Y) U22.1(1A)
NetU21_4: U21.4(2Y) U22.2(1B)
NetU21_10: U21.10(3Y) U22.4(2A)
NetU21_13: U21.13(4Y) U22.5(2B)
NetU22_3: U22.3(1Y) U22.9(3A)
NetU22_6: U22.6(2Y) U22.10(3B)
NetU23_3: U23.3(A2) U24.6(2Y)
NetU23_5: U23.5(A1) U24.3(1Y)
NetU23_12: U23.12(A4) U24.11(4Y)
NetU23_14: U23.14(A3) U24.8(3Y)

Not connected (* = marked no-connect by the designer): U18 5(3Q) 6(4Q)

### Notes on the sheet
- ALU
- Flag Regs
- (near U18) CF and ZF are CPU flags to control. They will be connected in following schematics. CF indicates whether there is carry in last operation, while ZF whether the last result is zero.
- 8-bit Computer:
- /

### Library data of the parts
D27-D36 = LED: as D2 on sheet Clock; CJO: 0; CJP: 0; CTA: 0; CTP: 0; FCS: 0.5; FV_MAX: 1e99; IKF: 0; IKR: 0; ISR: 1e-14; JSW: 0; JTUN: 0; JTUNSW: 0; KEG: 1; KF: 0; LEVEL: 1; N: 1; NBV: 1; NR: 1; NS: 1; PHP: 1; RS: 0; TCV: 0; TLEV: 0; TLEVC: 0; TM1: 0; TM2: 0; TPB: 0; TPHP: 0; TRS: 0; TRS2: 0; TT: 0; TTT1: 0; TTT2: 0; VJ: 1; XTITUN: 3
R43-R55 = Resistor: TC1: 0; SimulationGenericComponent: True; TC2: 0
S11-S13 = SPST SW: as S5 on sheet RegisterA
U17 = CMP-1620-00419-3: as U8 on sheet RegisterA; Mount: Through Hole; Min Operating Temperature: 0°C; Number of Outputs: 8; Max Operating Temperature: 70°C; Max Supply Voltage: 5.25V; Width: 6.35mm; Number of Pins: 20; RoHS Compliant: Yes; Turn-On Delay Time: 12ns; Termination: Through Hole; Number of Channels: 8; Number of Circuits: 8; Weight: 0.042297oz; Package Quantity: 20; Number of Transceivers: 8; Length: 24.33mm; Height: 4.57mm; REACH SVHC: No SVHC; Contact Plating: Gold; Number of Bits: 8; Lead Free: Lead Free; Case/Package: PDIP; Packaging: Rail/Tube; Radiation Hardening: No
U18 = CMP-1619-00777-2: as U9 on sheet RegisterA; Operating Temperature Range(C): 0 to 70; DatasheetVersion: SDLS067A; Generic Part Number: SN74LS173A; Output Type: TTL; PackageReference: N0016A; Code_JEDEC: MS-001
U20 U23 = CMP-1623-00518-2: 4-Bit Binary Full Adders With Fast Carry, N0016A, TUBE; Manufacturer: Texas Instruments; VCC(Min)(V): 4.75; Output Type: CMOS; Inputs: 9; Bits(#): 4; F @ Nom Voltage(Max)(Mhz): 35; Voltage(Nom)(V): 5; Rating: Catalog; tpd @ Nom Voltage(Max)(ns): 24; Schmitt Trigger: No; Technology Family: LS; Output Drive (IOL/IOH)(Max)(mA): 8/-0.4; Input Type: TTL; VCC(Max)(V): 5.25; Function: Arithmetic; ICC @ Nom Voltage(Max)(mA): 34; DatasheetVersion: SDLS095A; PackageReference: N0016A; Generic Part Number: SN74LS283; Type: Binary; Code_JEDEC: MS-001; Operating Temperature Range(C): 0 to 70
U21 = CMP-0806-00181-3: Quad 2-input positive-NOR gates, N0014A, TUBE; Manufacturer: Texas Instruments; Output Drive (IOL/IOH)(Max)(mA): 0.4/-8; F @ Nom Voltage(Max)(Mhz): 35; VCC(Max)(V): 5.25; Bits(#): 4; Input Type: TTL; VCC(Min)(V): 4.75; ICC @ Nom Voltage(Max)(mA): 0.027; tpd @ Nom Voltage(Max)(ns): 22; Voltage(Nom)(V): 5; Rating: Catalog; Generic Part Number: SN74LS02; PackageReference: N0014A; Operating Temperature Range(C): 0 to 70; DatasheetVersion: SDLS027; PackageVersion: http://www.ti.com/lit/ml/mpdi002c/mpdi002c.pdf; Output Type: TTL; Code_JEDEC: MS-001
U22 = CMP-0777-00259-3: as U5 on sheet Clock; PackageReference: N0014A; DatasheetVersion: SDLS033; Input Type: TTL; Operating Temperature Range(C): 0 to 70; Generic Part Number: SN74LS08

## Sheet RegisterMemAddr.SchDoc: Memory Address Register
size A4; Author: Ben Eater; DrawnBy: LittleYe233; SheetNumber: 6; SheetTotal: 6
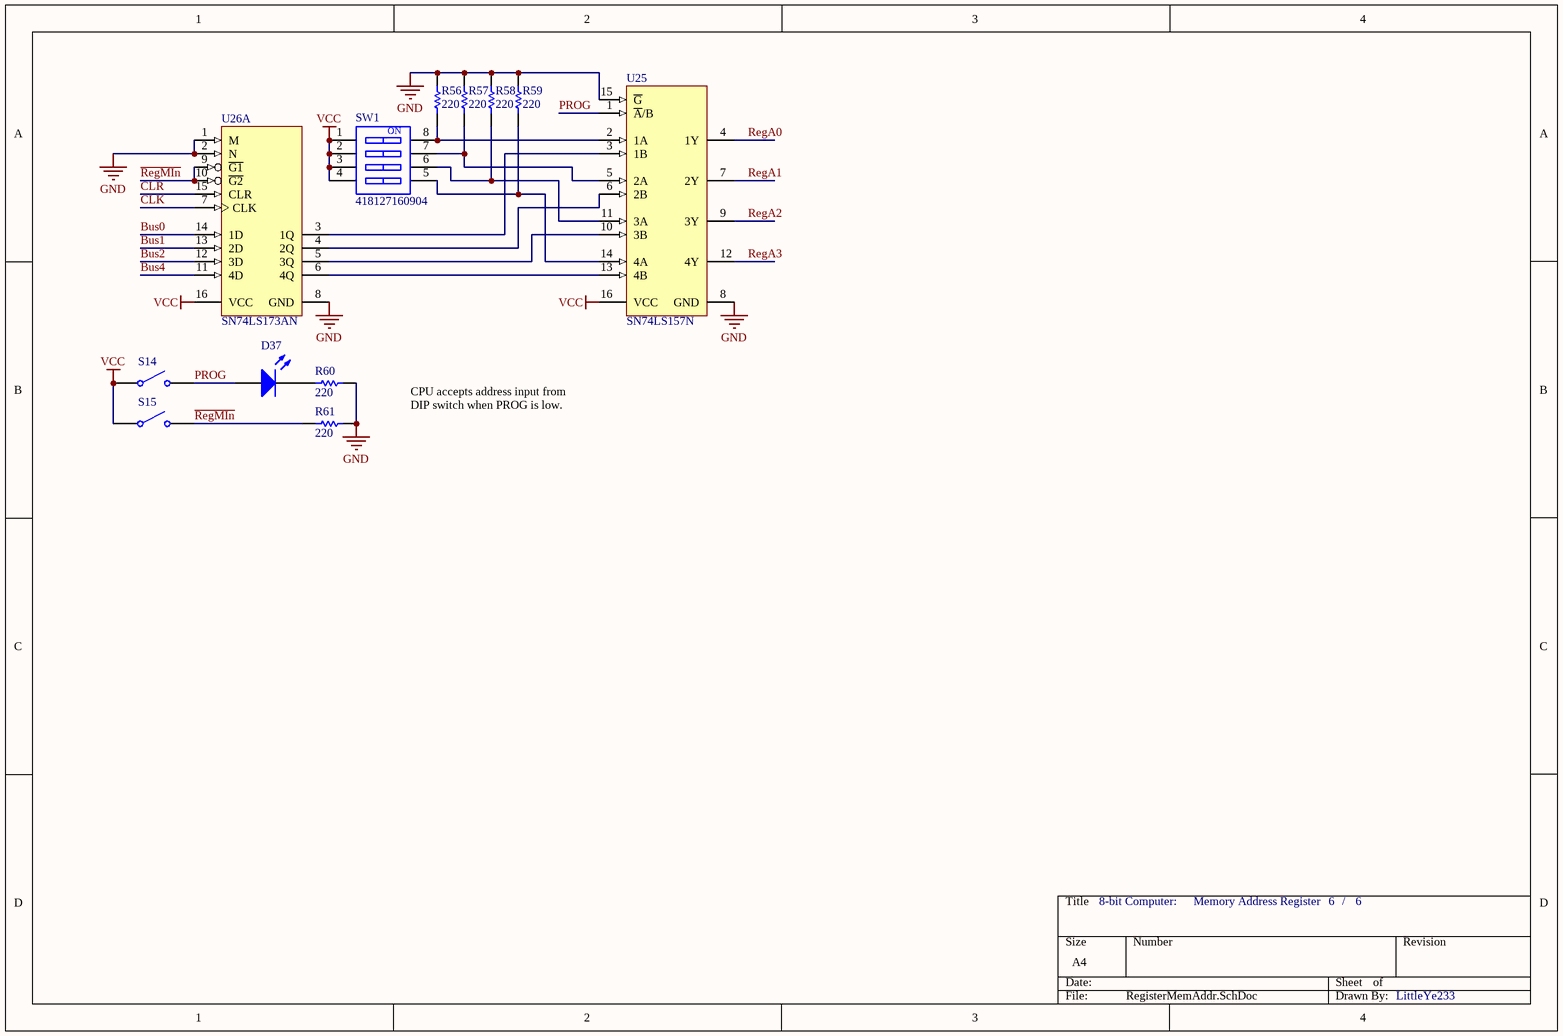
[diagram p5: RegisterMemAddr.SchDoc]

### Parts
D37  Light-Emitting Diode  (value not drawn)
R56  value 220  (hidden comment: Resistor)
R57  value 220  (hidden comment: Resistor)
R58  value 220  (hidden comment: Resistor)
R59  value 220  (hidden comment: Resistor)
R60  value 220  (hidden comment: Resistor)
R61  value 220  (hidden comment: Resistor)
S14  Single-Pole, Single-Throw Switch  (value not drawn)
S15  Single-Pole, Single-Throw Switch  (value not drawn)
SW1  418127160904  [418127160904]
U25  SN74LS157N  [N0016A]
U26  SN74LS173AN  [N0016A]  (part A of 2)

### Nets
GND: R56.2 R57.2 R58.2 R59.2 R60.1 R61.1 U25.8(GND) U25.15(~{G}) U26.1(M) U26.2(N) U26.8(GND)
VCC: S14.1 S15.1 SW1.1 SW1.2 SW1.3 SW1.4 U25.16(VCC) U26.16(VCC)
Bus0: U26.14(1D)
Bus1: U26.13(2D)
Bus2: U26.12(3D)
Bus4: U26.11(4D)
CLK: U26.7(CLK)
CLR: U26.15(CLR)
PROG: D37.1(A) S14.2 U25.1(~{A}/B)
~{RegMIn}: R61.2 S15.2 U26.9(~{G1}) U26.10(~{G2})
RegA0: U25.4(1Y)
RegA1: U25.7(2Y)
RegA2: U25.9(3Y)
RegA3: U25.12(4Y)
NetD37_2: D37.2(K) R60.2
NetR56_1: R56.1 SW1.8 U25.2(1A)
NetR57_1: R57.1 SW1.7 U25.5(2A)
NetR58_1: R58.1 SW1.6 U25.11(3A)
NetR59_1: R59.1 SW1.5 U25.14(4A)
NetU25_3: U25.3(1B) U26.3(1Q)
NetU25_6: U25.6(2B) U26.4(2Q)
NetU25_10: U25.10(3B) U26.5(3Q)
NetU25_13: U25.13(4B) U26.6(4Q)

### Notes on the sheet
- CPU accepts address input from DIP switch when PROG is low.
- 8-bit Computer:
- /
- (in symbol CMP-1439-00004-2) ON

### Library data of the parts
D37 = LED: as D2 on sheet Clock; CJO: 0; CJP: 0; CTA: 0; CTP: 0; FCS: 0.5; FV_MAX: 1e99; IKF: 0; IKR: 0; ISR: 1e-14; JSW: 0; JTUN: 0; JTUNSW: 0; KEG: 1; KF: 0; LEVEL: 1; N: 1; NBV: 1; NR: 1; NS: 1; PHP: 1; RS: 0; TCV: 0; TLEV: 0; TLEVC: 0; TM1: 0; TM2: 0; TPB: 0; TPHP: 0; TRS: 0; TRS2: 0; TT: 0; TTT1: 0; TTT2: 0; VJ: 1; XTITUN: 3
R56-R61 = Resistor: TC1: 0; SimulationGenericComponent: True; TC2: 0
S14 S15 = SPST SW: as S5 on sheet RegisterA
SW1 = CMP-1439-00004-2: NexarPartId: 57114393; Voltage Rating (DC): 24V; Throw Configuration: SPST; Number of Positions: 4; Pitch: 2.54mm; Current Rating: 25mA; Insulation Resistance: 100MΩ; Mechanical Life: 5kcycles; Body Material: Polyphenylene; Electrical Life: 2kcycles; Washable: Yes; Termination: PC Pin; Contact Plating: Gold; Length: 11.1mm; Min Operating Temperature: -40°C; Mount: Through Hole; Voltage Rating: 24V; Max Operating Temperature: 85°C; RoHS: Compliant
U25 = CMP-1633-00683-2: Quadruple 2-Line To 1-Line Data Selectors/Multiplexers, N0016A, TUBE; Manufacturer: Texas Instruments; Configuration: 2：1; Voltage(Nom)(V): 5; ICC @ Nom Voltage(Max)(mA): 16; VCC(Min)(V): 4.75; Channels(#): 4; Rating: Military; tpd @ Nom Voltage(Max)(ns): 14; F @ Nom Voltage(Max)(Mhz): 35; Technology Family: LS; Output Drive (IOL/IOH)(Max)(mA): 8/-0.4; Function: Encoder/Multiplexer; Schmitt Trigger: No; VCC(Max)(V): 5.25; Generic Part Number: SN74LS157; DatasheetVersion: SDLS058; Code_JEDEC: MS-001; Operating Temperature Range(C): 0 to 70; Type: Standard; PackageReference: N0016A
U26 = CMP-1619-00777-2: as U9 on sheet RegisterA; Operating Temperature Range(C): 0 to 70; DatasheetVersion: SDLS067A; Generic Part Number: SN74LS173A; Output Type: TTL; PackageReference: N0016A; Code_JEDEC: MS-001

## Sheet RAM.SchDoc: RAM
size A4; Author: Ben Eater; DrawnBy: LittleYe233; SheetNumber: 7; SheetTotal: 6
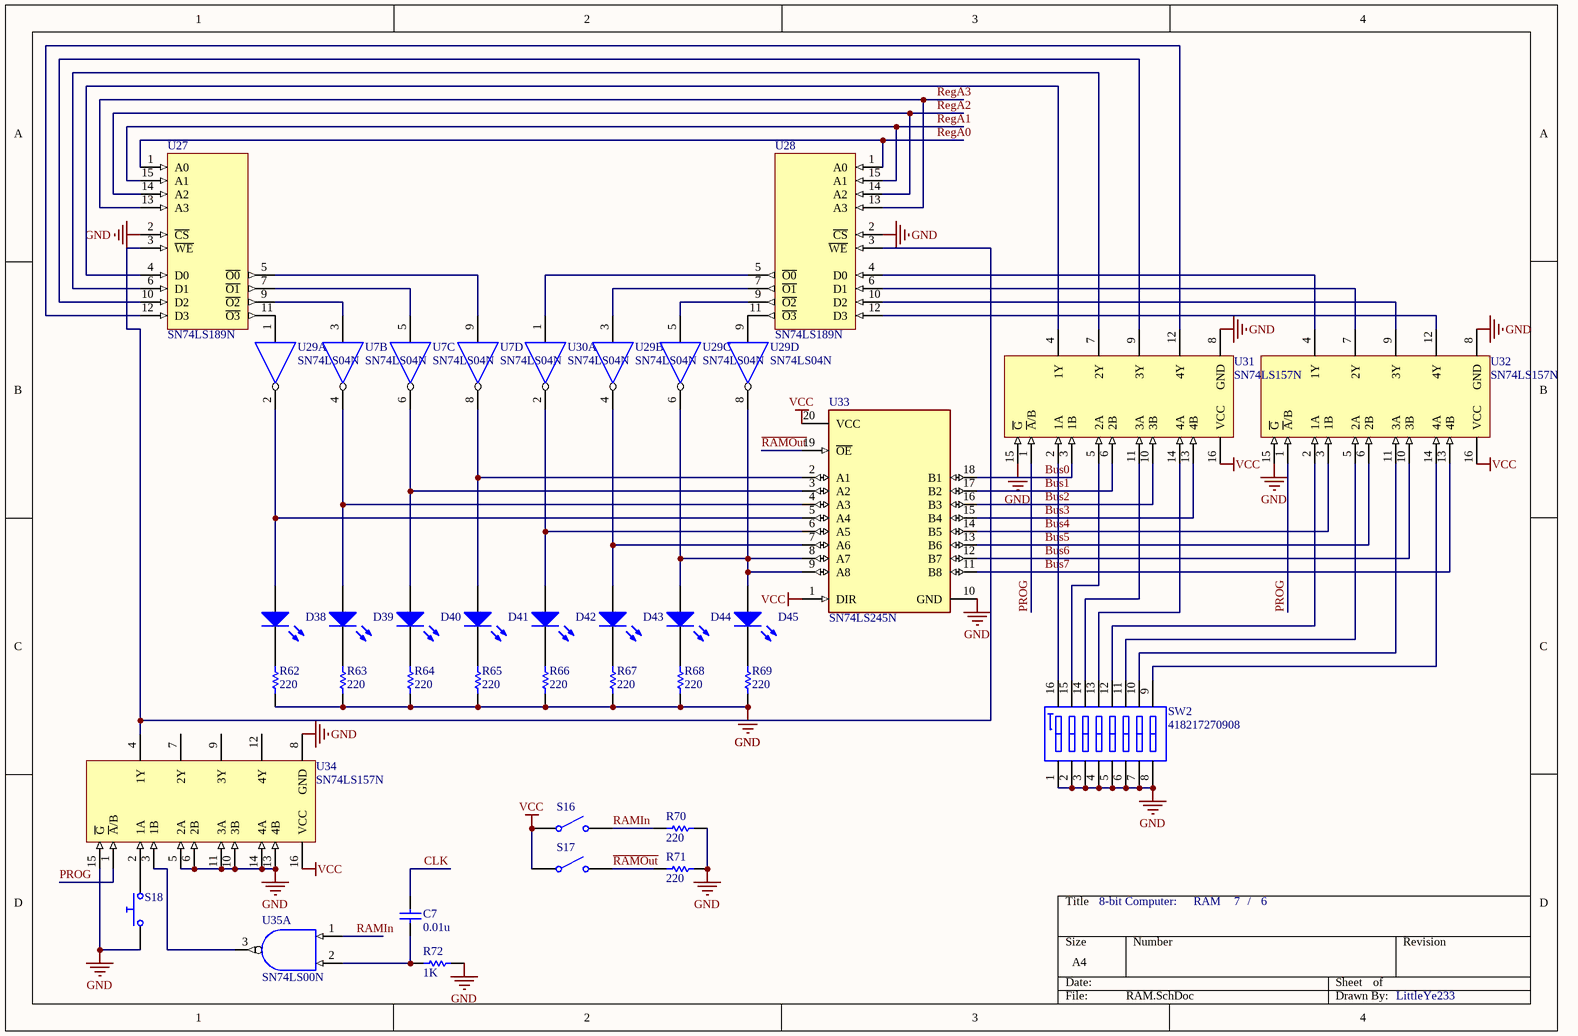
[diagram p6: RAM.SchDoc]

### Parts
C7  value 0.01u  (hidden comment: Capacitor)
D38  Light-Emitting Diode  (value not drawn)
D39  Light-Emitting Diode  (value not drawn)
D40  Light-Emitting Diode  (value not drawn)
D41  Light-Emitting Diode  (value not drawn)
D42  Light-Emitting Diode  (value not drawn)
D43  Light-Emitting Diode  (value not drawn)
D44  Light-Emitting Diode  (value not drawn)
D45  Light-Emitting Diode  (value not drawn)
R62  value 220  (hidden comment: Resistor)
R63  value 220  (hidden comment: Resistor)
R64  value 220  (hidden comment: Resistor)
R65  value 220  (hidden comment: Resistor)
R66  value 220  (hidden comment: Resistor)
R67  value 220  (hidden comment: Resistor)
R68  value 220  (hidden comment: Resistor)
R69  value 220  (hidden comment: Resistor)
R70  value 220  (hidden comment: Resistor)
R71  value 220  (hidden comment: Resistor)
R72  value 1K  (hidden comment: Resistor)
S16  Single-Pole, Single-Throw Switch  (value not drawn)
S17  Single-Pole, Single-Throw Switch  (value not drawn)
S18  Push Button Normally Opened  (value not drawn)
SW2  418217270908  [418217270908]
U7  SN74LS04N  [N0014A]  (parts B,C,D of 7)
U27  SN74LS189N
U28  SN74LS189N
U29  SN74LS04N  [N0014A]  (parts A,B,C,D of 7)
U30  SN74LS04N  [N0014A]  (part A of 7)
U31  SN74LS157N  [N0016A]
U32  SN74LS157N  [N0016A]
U33  SN74LS245N  [FP-N0020A-MFG]
U34  SN74LS157N  [N0016A]
U35  SN74LS00N  [N0014A]  (part A of 5)

### Nets
GND: R62.1 R63.1 R64.1 R65.1 R66.1 R67.1 R68.1 R69.1 R70.1 R71.1 R72.2 S18.1 SW2.1 SW2.2 SW2.3 SW2.4 SW2.5 SW2.6 SW2.7 SW2.8 U27.2(~{CS}) U28.2(~{CS}) U31.8(GND) U31.15(~{G}) U32.8(GND) U32.15(~{G}) U33.10(GND) U34.5(2A) U34.6(2B) U34.8(GND) U34.10(3B) U34.11(3A) U34.13(4B) U34.14(4A) U34.15(~{G})
VCC: S16.1 S17.1 U31.16(VCC) U32.16(VCC) U33.1(DIR) U33.20(VCC) U34.16(VCC)
Bus0: U31.3(1B) U33.18(B1)
Bus1: U31.6(2B) U33.17(B2)
Bus2: U31.10(3B) U33.16(B3)
Bus3: U31.13(4B) U33.15(B4)
Bus4: U32.3(1B) U33.14(B5)
Bus5: U32.6(2B) U33.13(B6)
Bus6: U32.10(3B) U33.12(B7)
Bus7: U32.13(4B) U33.11(B8)
CLK: C7.2
PROG: U31.1(~{A}/B) U32.1(~{A}/B) U34.1(~{A}/B)
~{RAMOut}: R71.2 S17.2 U33.19(~{OE})
RAMIn: R70.2 S16.2 U35.1(1A)
RegA0: U27.1(A0) U28.1(A0)
RegA1: U27.15(A1) U28.15(A1)
RegA2: U27.14(A2) U28.14(A2)
RegA3: U27.13(A3) U28.13(A3)
NetC7_1: C7.1 R72.1 U35.2(1B)
NetD38_1: D38.1(A) U29.2(~{1Y}) U33.5(A4)
NetD38_2: D38.2(K) R62.2
NetD39_1: D39.1(A) U7.4(~{2Y}) U33.4(A3)
NetD39_2: D39.2(K) R63.2
NetD40_1: D40.1(A) U7.6(~{3Y}) U33.3(A2)
NetD40_2: D40.2(K) R64.2
NetD41_1: D41.1(A) U7.8(~{4Y}) U33.2(A1)
NetD41_2: D41.2(K) R65.2
NetD42_1: D42.1(A) U30.2(~{1Y}) U33.6(A5)
NetD42_2: D42.2(K) R66.2
NetD43_1: D43.1(A) U29.4(~{2Y}) U33.7(A6)
NetD43_2: D43.2(K) R67.2
NetD44_1: D44.1(A) D45.1(A) U29.6(~{3Y}) U29.8(~{4Y}) U33.8(A7) U33.9(A8)
NetD44_2: D44.2(K) R68.2
NetD45_2: D45.2(K) R69.2
NetS18_2: S18.2 U34.2(1A)
NetSW2_9: SW2.9 U32.14(4A)
NetSW2_10: SW2.10 U32.11(3A)
NetSW2_11: SW2.11 U32.5(2A)
NetSW2_12: SW2.12 U32.2(1A)
NetSW2_13: SW2.13 U31.14(4A)
NetSW2_14: SW2.14 U31.11(3A)
NetSW2_15: SW2.15 U31.5(2A)
NetSW2_16: SW2.16 U31.2(1A)
NetU7_3: U7.3(2A) U27.9(~{O2})
NetU7_5: U7.5(3A) U27.7(~{O1})
NetU7_9: U7.9(4A) U27.5(~{O0})
NetU27_3: U27.3(~{WE}) U28.3(~{WE}) U34.4(1Y)
NetU27_4: U27.4(D0) U31.4(1Y)
NetU27_6: U27.6(D1) U31.7(2Y)
NetU27_10: U27.10(D2) U31.9(3Y)
NetU27_11: U27.11(~{O3}) U29.1(1A)
NetU27_12: U27.12(D3) U31.12(4Y)
NetU28_4: U28.4(D0) U32.4(1Y)
NetU28_5: U28.5(~{O0}) U30.1(1A)
NetU28_6: U28.6(D1) U32.7(2Y)
NetU28_7: U28.7(~{O1}) U29.3(2A)
NetU28_9: U28.9(~{O2}) U29.5(3A)
NetU28_10: U28.10(D2) U32.9(3Y)
NetU28_11: U28.11(~{O3}) U29.9(4A)
NetU28_12: U28.12(D3) U32.12(4Y)
NetU34_3: U34.3(1B) U35.3(1Y)

Not connected (* = marked no-connect by the designer): U34 7(2Y) 9(3Y) 12(4Y)

### Notes on the sheet
- 8-bit Computer:
- /

### Library data of the parts
C7 = Capacitor: SimulationGenericComponent: True
D38-D45 = LED: as D2 on sheet Clock; CJO: 0; CJP: 0; CTA: 0; CTP: 0; FCS: 0.5; FV_MAX: 1e99; IKF: 0; IKR: 0; ISR: 1e-14; JSW: 0; JTUN: 0; JTUNSW: 0; KEG: 1; KF: 0; LEVEL: 1; N: 1; NBV: 1; NR: 1; NS: 1; PHP: 1; RS: 0; TCV: 0; TLEV: 0; TLEVC: 0; TM1: 0; TM2: 0; TPB: 0; TPHP: 0; TRS: 0; TRS2: 0; TT: 0; TTT1: 0; TTT2: 0; VJ: 1; XTITUN: 3
R62-R72 = Resistor: TC1: 0; SimulationGenericComponent: True; TC2: 0
S16 S17 = SPST SW: as S5 on sheet RegisterA
S18 = Push Button NO: as S3 on sheet Clock
SW2 = CMP-1441-00017-1: WS-DITU 2.54 mm right angled compact THT Dip Switch with raised actuator; Manufacturer: Wuerth Elektronik; NoPins: 16; ComponentLink2URL: http://katalog.we-online.de/em/datasheet/4182172709xx.pdf; ComponentLink2Description: Datasheet; PartNumber: 418217270908; PackageReference: 418217270908; ComponentLink1URL: http://www.we-online.com; ComponentLink1Description: Manufacturer URL
U7 U29 U30 = CMP-1615-00911-2: as U7 on sheet Clock; Operating Temperature Range(C): 0 to 70; DatasheetVersion: SDLS029C; Generic Part Number: SN74LS04; Code_JEDEC: MS-001; PackageReference: N0014A
U31 U32 U34 = CMP-1633-00683-2: as U25 on sheet RegisterMemAddr; Generic Part Number: SN74LS157; DatasheetVersion: SDLS058; Code_JEDEC: MS-001; Operating Temperature Range(C): 0 to 70; Type: Standard; PackageReference: N0016A
U33 = CMP-1620-00419-3: as U8 on sheet RegisterA; Mount: Through Hole; Min Operating Temperature: 0°C; Number of Outputs: 8; Max Operating Temperature: 70°C; Max Supply Voltage: 5.25V; Width: 6.35mm; Number of Pins: 20; RoHS Compliant: Yes; Turn-On Delay Time: 12ns; Termination: Through Hole; Number of Channels: 8; Number of Circuits: 8; Weight: 0.042297oz; Package Quantity: 20; Number of Transceivers: 8; Length: 24.33mm; Height: 4.57mm; REACH SVHC: No SVHC; Contact Plating: Gold; Number of Bits: 8; Lead Free: Lead Free; Case/Package: PDIP; Packaging: Rail/Tube; Radiation Hardening: No
U35 = CMP-1627-00476-2: Quad 2-input positive-NAND gates, N0014A, TUBE; Manufacturer: Texas Instruments; VCC(Min)(V): 4.75; F @ Nom Voltage(Max)(Mhz): 35; Voltage(Nom)(V): 5; Rating: Catalog; tpd @ Nom Voltage(Max)(ns): 22; Output Type: TTL; Schmitt Trigger: No; Output Drive (IOL/IOH)(Max)(mA): 0.4/-16; Technology Family: LS; ICC @ Nom Voltage(Max)(mA): 0.022; VCC(Max)(V): 5.25; Bits(#): 4; Code_JEDEC: MS-001; Generic Part Number: SN74LS00; Input Type: TTL; Operating Temperature Range(C): 0 to 70; PackageReference: N0014A; DatasheetVersion: SDLS025B

## Sheet ProgramCounter.SchDoc: Program Counter
size A4; Author: Ben Eater; DrawnBy: LittleYe233; SheetNumber: 7; SheetTotal: 7
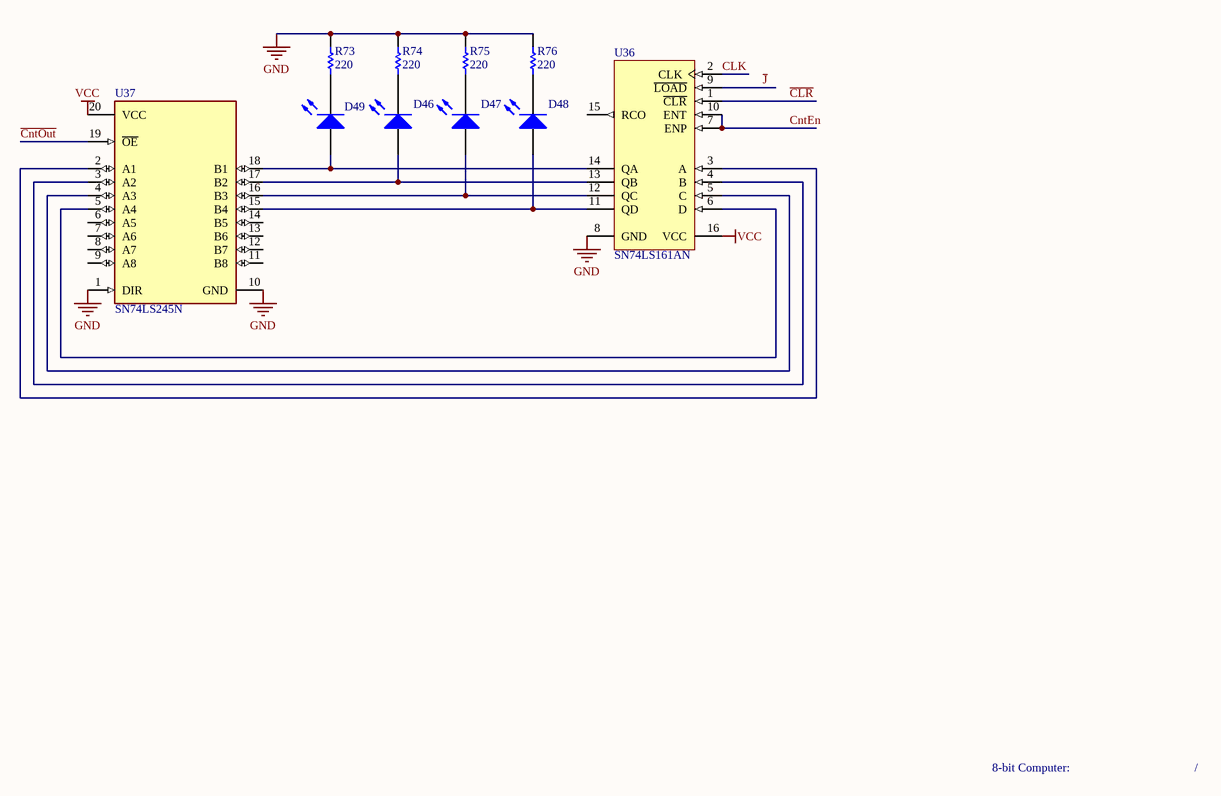
[diagram p7: ProgramCounter.SchDoc]

### Parts
D46  Light-Emitting Diode  (value not drawn)
D47  Light-Emitting Diode  (value not drawn)
D48  Light-Emitting Diode  (value not drawn)
D49  Light-Emitting Diode  (value not drawn)
R73  value 220  (hidden comment: Resistor)
R74  value 220  (hidden comment: Resistor)
R75  value 220  (hidden comment: Resistor)
R76  value 220  (hidden comment: Resistor)
U36  SN74LS161AN  [N0016A]
U37  SN74LS245N  [FP-N0020A-MFG]

### Nets
GND: R73.2 R74.2 R75.2 R76.2 U36.8(GND) U37.1(DIR) U37.10(GND)
VCC: U36.16(VCC) U37.20(VCC)
~{CLR}: U36.1(~{CLR})
~{CntOut}: U37.19(~{OE})
CLK: U36.2(CLK)
CntEn: U36.7(ENP) U36.10(ENT)
~{J}: U36.9(~{LOAD})
NetD46_1: D46.1(A) U36.13(QB) U37.17(B2)
NetD46_2: D46.2(K) R74.1
NetD47_1: D47.1(A) U36.12(QC) U37.16(B3)
NetD47_2: D47.2(K) R75.1
NetD48_1: D48.1(A) U36.11(QD) U37.15(B4)
NetD48_2: D48.2(K) R76.1
NetD49_1: D49.1(A) U36.14(QA) U37.18(B1)
NetD49_2: D49.2(K) R73.1
NetU36_3: U36.3(A) U37.2(A1)
NetU36_4: U36.4(B) U37.3(A2)
NetU36_5: U36.5(C) U37.4(A3)
NetU36_6: U36.6(D) U37.5(A4)

Not connected (* = marked no-connect by the designer): U36 15(RCO); U37 6(A5) 7(A6) 8(A7) 9(A8) 11(B8) 12(B7) 13(B6) 14(B5)

### Notes on the sheet
- 8-bit Computer:
- /

### Library data of the parts
D46-D49 = LED: as D2 on sheet Clock; CJO: 0; CJP: 0; CTA: 0; CTP: 0; FCS: 0.5; FV_MAX: 1e99; IKF: 0; IKR: 0; ISR: 1e-14; JSW: 0; JTUN: 0; JTUNSW: 0; KEG: 1; KF: 0; LEVEL: 1; N: 1; NBV: 1; NR: 1; NS: 1; PHP: 1; RS: 0; TCV: 0; TLEV: 0; TLEVC: 0; TM1: 0; TM2: 0; TPB: 0; TPHP: 0; TRS: 0; TRS2: 0; TT: 0; TTT1: 0; TTT2: 0; VJ: 1; XTITUN: 3
R73-R76 = Resistor: TC1: 0; SimulationGenericComponent: True; TC2: 0
U36 = CMP-1623-00512-2: Synchronous 4-Bit Binary Counters, N0016A, TUBE; Manufacturer: Texas Instruments; VCC(Max)(V): 5.25; tpd @ Nom Voltage(Max)(ns): 35; Output Type: CMOS; Input Type: TTL; ICC @ Nom Voltage(Max)(mA): 32; VCC(Min)(V): 4.75; Technology Family: LS; Voltage(Nom)(V): 5; Output Drive (IOL/IOH)(Max)(mA): 8/-0.4; Inputs: 1; Schmitt Trigger: No; Rating: Catalog; Bits(#): 4; Type: Binary; Generic Part Number: SN74LS161A; Code_JEDEC: MS-001; F @ Nom Voltage(Max)(Mhz): 35; Function: Counter; PackageReference: N0016A; DatasheetVersion: SDLS060; Operating Temperature Range(C): 0 to 70
U37 = CMP-1620-00419-3: as U8 on sheet RegisterA; Mount: Through Hole; Min Operating Temperature: 0°C; Number of Outputs: 8; Max Operating Temperature: 70°C; Max Supply Voltage: 5.25V; Width: 6.35mm; Number of Pins: 20; RoHS Compliant: Yes; Turn-On Delay Time: 12ns; Termination: Through Hole; Number of Channels: 8; Number of Circuits: 8; Weight: 0.042297oz; Package Quantity: 20; Number of Transceivers: 8; Length: 24.33mm; Height: 4.57mm; REACH SVHC: No SVHC; Contact Plating: Gold; Number of Bits: 8; Lead Free: Lead Free; Case/Package: PDIP; Packaging: Rail/Tube; Radiation Hardening: No

## Nets that join several sheets
GND: Clock (17 pins), RegisterA (18 pins), RegisterB (17 pins), RegisterInstruction (17 pins), ALU (21 pins), RegisterMemAddr (11 pins), RAM (35 pins), ProgramCounter (7 pins)
VCC: Clock (17 pins), RegisterA (7 pins), RegisterB (6 pins), RegisterInstruction (6 pins), ALU (8 pins), RegisterMemAddr (8 pins), RAM (7 pins), ProgramCounter (U36.16 U37.20)
Bus0: RegisterA (U8.18 U9.14), RegisterB (U11.18 U12.14), RegisterInstruction (U14.18 U15.14), ALU (U17.18), RegisterMemAddr (U26.14), RAM (U31.3 U33.18)
Bus1: RegisterA (U8.17 U9.13), RegisterB (U11.17 U12.13), RegisterInstruction (U14.17 U15.13), ALU (U17.17), RegisterMemAddr (U26.13), RAM (U31.6 U33.17)
Bus2: RegisterA (U8.16 U9.12), RegisterB (U11.16 U12.12), RegisterInstruction (U14.16 U15.12), ALU (U17.16), RegisterMemAddr (U26.12), RAM (U31.10 U33.16)
Bus3: RegisterA (U8.15 U9.11), RegisterB (U11.15 U12.11), RegisterInstruction (U14.15 U15.11), ALU (U17.15), RAM (U31.13 U33.15)
Bus4: RegisterA (U8.14 U10.14), RegisterB (U11.14 U13.14), RegisterInstruction (U14.14 U16.14), ALU (U17.14), RegisterMemAddr (U26.11), RAM (U32.3 U33.14)
Bus5: RegisterA (U8.13 U10.13), RegisterB (U11.13 U13.13), RegisterInstruction (U14.13 U16.13), ALU (U17.13), RAM (U32.6 U33.13)
Bus6: RegisterA (U8.12 U10.12), RegisterB (U11.12 U13.12), RegisterInstruction (U14.12 U16.12), ALU (U17.12), RAM (U32.10 U33.12)
Bus7: RegisterA (U8.11 U10.11), RegisterB (U11.11 U13.11), RegisterInstruction (U14.11 U16.11), ALU (U17.11), RAM (U32.13 U33.11)
CLK: Clock (D2.1 J1.2 U5.8), RegisterA (U9.7 U10.7), RegisterB (U12.7 U13.7), RegisterInstruction (U15.7 U16.7), ALU (U18.7), RegisterMemAddr (U26.7), RAM (C7.2), ProgramCounter (U36.2)
CLR: RegisterA (R20.2 S4.2 U9.15 U10.15), RegisterB (U12.15 U13.15), RegisterInstruction (U15.15 U16.15), ALU (U18.15), RegisterMemAddr (U26.15)
PROG: RegisterMemAddr (D37.1 S14.2 U25.1), RAM (U31.1 U32.1 U34.1)
RegA0: RegisterA (D3.1 U8.2 U9.3), ALU (U20.6), RegisterMemAddr (U25.4), RAM (U27.1 U28.1)
RegA1: RegisterA (D4.1 U8.3 U9.4), ALU (U20.2), RegisterMemAddr (U25.7), RAM (U27.15 U28.15)
RegA2: RegisterA (D5.1 U8.4 U9.5), ALU (U20.15), RegisterMemAddr (U25.9), RAM (U27.14 U28.14)
RegA3: RegisterA (D6.1 U8.5 U9.6), ALU (U20.11), RegisterMemAddr (U25.12), RAM (U27.13 U28.13)
RegA4: RegisterA (D7.1 U8.6 U10.3), ALU (U23.6)
RegA5: RegisterA (D8.1 U8.7 U10.4), ALU (U23.2)
RegA6: RegisterA (D9.1 U8.8 U10.5), ALU (U23.15)
RegA7: RegisterA (D10.1 U8.9 U10.6), ALU (U23.11)
RegB0: RegisterB (D11.1 U11.2 U12.3), ALU (U19.1)
RegB1: RegisterB (D12.1 U11.3 U12.4), ALU (U19.4)
RegB2: RegisterB (D13.1 U11.4 U12.5), ALU (U19.9)
RegB3: RegisterB (D14.1 U11.5 U12.6), ALU (U19.12)
RegB4: RegisterB (D15.1 U11.6 U13.3), ALU (U24.1)
RegB5: RegisterB (D16.1 U11.7 U13.4), ALU (U24.4)
RegB6: RegisterB (D17.1 U11.8 U13.5), ALU (U24.9)
RegB7: RegisterB (D18.1 U11.9 U13.6), ALU (U24.12)